# Altium schematic sheet Batt_Charge.SchDoc
size A4; SheetNumber: 4; SheetTotal: 13
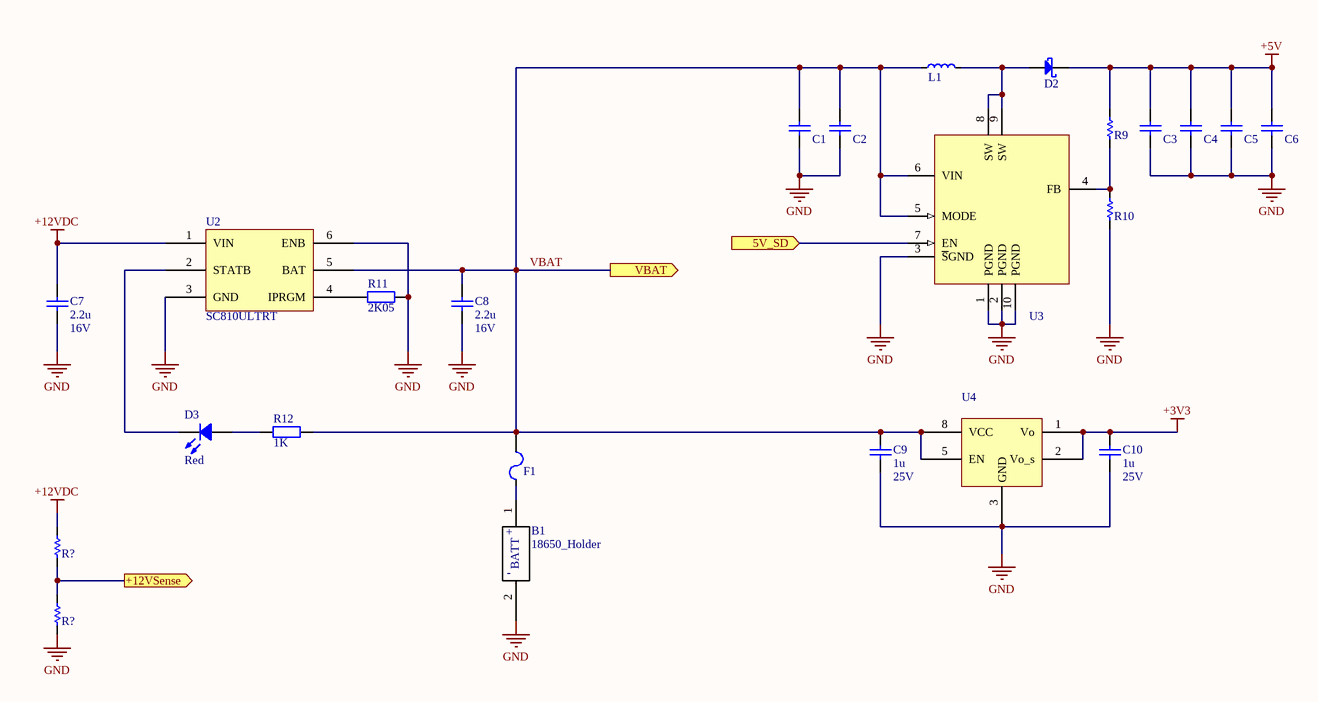
[diagram p0: Batt_Charge.SchDoc]

## Parts
(Parts that share a designator on the sheet are numbered #1, #2 ... from top to bottom, then left to right.)
B1  18650_Holder  [1042]
C1  10µF  [1206C]  (value not drawn)
C2  10µF  [1206C]  (value not drawn)
C3  10µF  [1206C]  (value not drawn)
C4  10µF  [1206C]  (value not drawn)
C5  10µF  [1206C]  (value not drawn)
C6  10µF  [1206C]  (value not drawn)
C7  2.2u  Voltage - Rated: 16V  [CAP 0805/2012 - 1.4MM]
C8  2.2u  Voltage - Rated: 16V  [CAP 0805/2012 - 1.4MM]
C9  1u  Voltage - Rated: 25V  [CAP 0805/2012 - 1.4MM]
C10  1u  Voltage - Rated: 25V  [CAP 0805/2012 - 1.4MM]
D2  PMEG3020ER,115  [SOD123]  (value not drawn)
D3  Red  [LED 0603/1608 RED]
F1  TR/3216TD10-R  [1206]  (value not drawn)
L1  10 µH  [INDC2520X100N]  (value not drawn)
R9  63.4 kOhms  [0603R]  (value not drawn)
R10  SMT  [0603R]  (value not drawn)
R11  2K05  [RES 0603/1608]
R12  1K  [RES 0603/1608]
R?#1  100 kOhms  [0603R]  (value not drawn)
R?#2  27 kOhms  [0603R]  (value not drawn)
U2  SC810ULTRT  [SC810ULTRT]
U3  MCP1665T-E/MRA  [MCP1665T-EMRA]  (value not drawn)
U4  BD33HC0WEFJ-E2  [BD33HC0WEFJ]  (value not drawn)

## Ports
5V_SD (in), +12VSense (out), VBAT (out)

## Nets
+3V3: C10.2 U4.1(Vo) U4.2(Vo_s)
+5V: C3.1 C4.1 C5.1 C6.1 D2.1(K) R9.2
+12VDC: C7.2 R?#1.2 U2.1(VIN)
GND: B1.2(NEG) C1.2 C2.2 C3.2 C4.2 C5.2 C6.2 C7.1 C8.1 C9.1 C10.1 R10.1 R11.2 R?#2.1 U2.3(GND) U2.6(ENB) U3.1(PGND) U3.2(PGND) U3.3(~{S}GND) U3.10(PGND) U4.3(GND)
5V_SD: U3.7(EN) ; port 5V_SD
+12VSense: R?#1.1 R?#2.2 ; port +12VSense
VBAT: C1.1 C2.1 C8.2 C9.2 F1.2 L1.1 R12.2 U2.5(BAT) U3.5(MODE) U3.6(VIN) U4.5(EN) U4.8(VCC) ; port VBAT
NetB1_1: B1.1(POS) F1.1
NetD2_2: D2.2(A) L1.2 U3.8(SW) U3.9(SW)
NetD3_1: D3.1 R12.1
NetD3_2: D3.2 U2.2(STATB)
NetR9_1: R9.1 R10.2 U3.4(FB)
NetR11_1: R11.1 U2.4(IPRGM)

## Notes on the sheet
- (in symbol 1042) +; BATT; -

## Library data of the parts
B1 = 1042: 18650 Cell and Holder 3-4.2V
C1-C6 = 1000-0124: CAP CER 10UF 16V X7R 1206; Manufacturer: Walsin Technology Corporation; Manufacturer Part Number: 1206B106K160CT; id: 442554; inventory_price: 1; x_Link_Description: Datasheet; x_max_temp: 125°C; x_min_temp: -55°C; x_Tolerance: ±10%; partnumber: 1000-0124; created_on: 26/10/2021 11:23:13 AM; parttype: Ceramic Capacitors; rohs: 1; updated_on: 26/10/2021 11:23:26 AM; x_Capacitance: 10µF; x_Link_URL: http://www.passivecomponent.com/wp-content/uploads/2018/10/MLCC.pdf; x_temp_coef: X7R; x_Vol: 16V
C7 C8 = EMK212B7225KG-T: CAP CER 2.2UF 16V X7R 0805; Manufacturer: Taiyo Yuden; Package Imperial: 0805; Package Metric: 2012; Tolerance: 0.1; Value: 2.2u; Part Number: EMK212B7225KG-T; Dielectric: X7R; Digi-Key Part Number: 587-1431-1-ND
C9 C10 = TMK212B7105KG-T: CAP CER 1UF 25V X7R 0805; Manufacturer: Taiyo Yuden; Package Imperial: 0805; Package Metric: 2012; Tolerance: 0.1; Value: 1u; Part Number: TMK212B7105KG-T; Dielectric: X7R; Digi-Key Part Number: 587-1281-1-ND
D2 = 1047-0008: DIODE SCHOTTKY 30V 2A SOD123W; Manufacturer: Nexperia USA Inc.; Current: A; Voltage: V; id: 429535; inventory_price: 0.2867; x_Link_Description: Datasheet; Supplier 1: Digi-Key; Supplier Part Number 1: CUS10S30H3FTR-ND; Manufacturer Part Number: PMEG3020ER,115; Mount: SMT; ComponentLink1URL: https://toshiba.semicon-storage.com/info/docget.jsp?did=14077&prodName=CUS10S30; ComponentLink1Description: Datasheet; partnumber: 1047-0008; created_on: 19/05/2021 12:32:57 PM; parttype: Diodes - Rectifiers - Single; rohs: 1; updated_on: 18/10/2021 4:50:09 PM; x_Link_URL: https://assets.nexperia.com/documents/data-sheet/PMEG3020ER.pdf
D3 = LTST-C190KRKT: Red 631nm LED Indication - Discrete 2V 0603 (1608 Metric); Manufacturer: Lite-On Inc.; Part Number: LTST-C190KRKT; Value: Red; Digi-Key Part Number: 160-1436-1-ND
F1 = TR/3216TD10-R: fuse holder; Manufacturer Part Number: Eaton - Electronics Division; Current: 10A; inventory_price: 1.95; partnumber: TR/3216TD10-R; URL Datasheet: https://www.eaton.com/content/dam/eaton/products/electronic-components/resources/data-sheet/eaton-3216td-time-delay-chip-surface-mount-fuse-data-sheet.pdf; Digikey PN: TR/3216TD10-R; manufacturer: Eaton - Electronics Division; parttype: Fuses
L1 = 1002-0031: FIXED IND 10UH 750MA 650MOHM SMD; Manufacturer Part Number: MAKK2520H100M; manufacturer: Taiyo Yuden; id: 462234; inventory_price: 0.28; x_Capacitance: Not Applicable; x_Link_Description: Datasheet; x_max_temp: 105°C; x_min_temp: -40°C; x_port_to_unleashed: No; x_Tolerance: ±20%; ComponentLink1Description: Datasheet; ComponentLink1URL: https://www.bourns.com/docs/Product-Datasheets/SRR1260.pdf; partnumber: 1002-0031; created_on: 3/04/2022 8:17:03 AM; parttype: Fixed Inductors; rohs: 1; updated_on: 6/04/2022 9:21:30 PM; x_current: 750 mA; x_inductance: 10 µH; x_Link_URL: https://ds.yuden.co.jp/TYCOMPAS/ut/detail?pn=MAKK2520H100M &u=M; x_Power: Not Applicable; x_resistance: Not Applicable; x_temp_coef: Not Applicable; x_Vol: Not Applicable
R9 = 1007-0174: RES 63.4K OHM 1% 1/10W 0603; Manufacturer: Stackpole Electronics Inc; Manufacturer Part Number: RMCF0603FT63K4; id: 462399; inventory_price: 0.1; x_Capacitance: Not Applicable; x_Link_Description: Datasheet; x_max_temp: 155°C; x_min_temp: -55°C; x_port_to_unleashed: No; x_Power: 0.1W, 1/10W; x_temp_coef: ±100ppm/°C; partnumber: 1007-0174; created_on: 6/04/2022 9:39:45 PM; parttype: Chip Resistor - Surface Mount; rohs: 1; updated_on: 6/04/2022 9:40:00 PM; x_current: Not Applicable; x_inductance: Not Applicable; x_Link_URL: https://www.seielect.com/catalog/sei-rmcf_rmcp.pdf; x_resistance: 63.4 kOhms; x_Tolerance: ±1%; x_Vol: Not Applicable
R10 = 1007-0018: RES 20K OHM 1% 1/8W 0603; Manufacturer: Stackpole Electronics Inc; Manufacturer Part Number: RNCP0603FTD20K0; id: 377086; inventory_price: 0.1; x_Capacitance: Not Applicable; x_Link_Description: Datasheet; x_max_temp: 155°C; x_min_temp: -55°C; x_port_to_unleashed: No; x_Power: 0.125W, 1/8W; x_resistance: 20 kOhms; x_temp_coef: ±100ppm/°C; partnumber: 1007-0018; created_on: 17/03/2020 11:40:16 AM; parttype: Chip Resistor - Surface Mount; rohs: 1; updated_on: 8/04/2022 11:10:51 AM; x_current: Not Applicable; x_inductance: Not Applicable; x_Link_URL: https://www.seielect.com/catalog/sei-rncp.pdf; x_Tolerance: ±1%; x_Vol: Not Applicable
R11 = RC0603FR-072K05L: RES SMD 2.05K OHM 1% 1/10W 0603; Manufacturer: Yageo; Package Imperial: 0603; Package Metric: 1608; Temperature Coefficient: ±100ppm/°C; Power (Watts): 0.1W, 1/10W; Part Number: RC0603FR-072K05L; Value: 2K05; Tolerance: ±1%; Digi-Key Part Number: 311-2.05KHRCT-ND
R12 = RC0603FR-071KL: RES SMD 1K OHM 1% 1/10W 0603; Manufacturer: Yageo; Package Imperial: 0603; Package Metric: 1608; Temperature Coefficient: ±100ppm/°C; Power (Watts): 0.1W, 1/10W; Part Number: RC0603FR-071KL; Value: 1K; Tolerance: ±1%; Digi-Key Part Number: 311-1.00KHRCT-ND
R?#1 = 1007-0133: RES 100K OHM 1% 1/10W 0603; Manufacturer: Walsin Technology Corporation; Manufacturer Part Number: WR06X1003FTL; id: 436176; inventory_price: 0.0022; x_link_description: Datasheet; x_max_temp: 155°C; x_min_temp: -55°C; partnumber: 1007-0133; created_on: 10/08/2021 12:08:36 PM; parttype: Chip Resistor - Surface Mount; rohs: 1; updated_on: 10/08/2021 12:25:24 PM; x_link_url: http://www.passivecomponent.com/wp-content/uploads/chipR/ASC_WR.pdf; x_power: 1/10W; x_Tolerance: ±1%
R?#2 = 1007-0190: RES 27K OHM 1% 1/10W 0603; Manufacturer: TE Connectivity Passive Product; Manufacturer Part Number: CRGCQ0603F27K; id: 474439; inventory_price: 0.1; x_Capacitance: Not Applicable; x_link_description: Datasheet; x_max_temp: 155°C; x_min_temp: -55°C; x_port_to_unleashed: No; x_power: 0.1W, 1/10W; x_temp_coef: ±100ppm/°C; partnumber: 1007-0190; created_on: 15/05/2022 1:25:00 PM; parttype: Chip Resistor - Surface Mount; rohs: 1; updated_on: 15/05/2022 1:25:09 PM; x_current: Not Applicable; x_inductance: Not Applicable; x_link_url: https://www.te.com/commerce/DocumentDelivery/DDEController?Action=srchrtrv&DocNm=1773204-3&DocType=DS&DocLang=English; x_resistance: 27 kOhms; x_Tolerance: ±1%; x_vol: Not Applicable
U2 = SC810ULTRT: IC BATT CHG LI-ION 1CELL 6MLP
U3 = 1028-0017: IC REG BOOST ADJ 1A 10VQFN; manufacturer: Microchip Technology; id: 461088; inventory_price: 1.87; x_Capacitance: Not Applicable; x_Link_Description: Datasheet; x_max_temp: 125°C (TA); x_min_temp: -40°C; x_port_to_unleashed: No; partnumber: 1028-0017; Manufacturer Part Number: MCP1665T-E/MRA; created_on: 23/03/2022 9:51:43 PM; parttype: PMIC - Voltage Regulators - DC DC Switching Regulators; rohs: 1; updated_on: 28/03/2022 9:26:58 PM; x_current: Not Applicable; x_inductance: Not Applicable; x_Link_URL: https://ww1.microchip.com/downloads/en/DeviceDoc/20005872A.pdf; x_Power: Not Applicable; x_resistance: Not Applicable; x_temp_coef: Not Applicable; x_Tolerance: Not Applicable; x_Vol: Not Applicable
U4 = BD33HC0WEFJ-E2: manufacturer: Rohm Semiconductor; Current: 1A; Maximun Temperature: -25; Minimum Temperature: 85; Power: 3.3W; Voltage: 3.3V; inventory_price: 0.93; partnumber: BD33HC0WEFJ-E2; Manufacturer Part Number: BD33HC0WEFJ-E2; URL Datasheet: https://fscdn.rohm.com/en/products/databook/datasheet/ic/power/linear_regulator/bdxxhc0wefj-e.pdf; Digikey PN: BD33HC0WEFJ-E2CT-ND; parttype: PMIC - Voltage Regulators - Linear